# Altium project PCB_Project1.PrjPCB
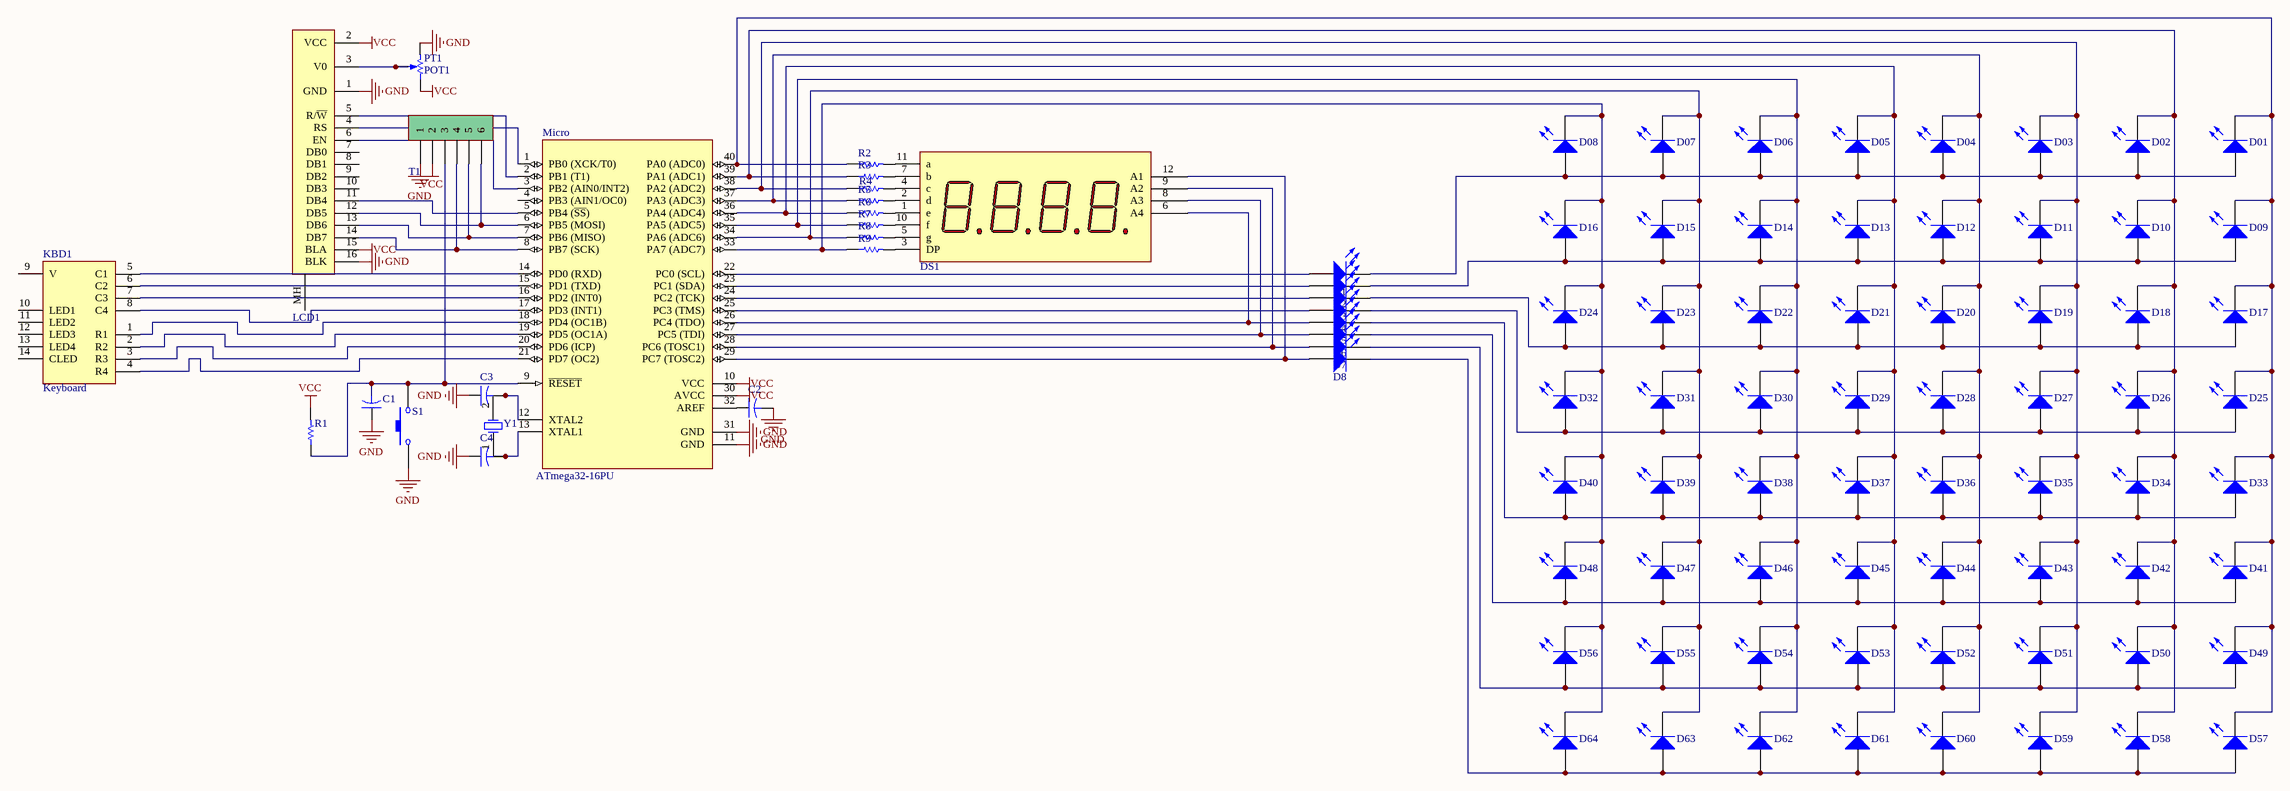
[diagram p0: Sheet1.SchDoc]
3 sheets, 96 parts. Net scope: global (net labels, ports and power ports of the same name join across sheets).
Board file: PCB1.PcbDoc
Sheets:
  Sheet1.SchDoc
  Sheet2.SchDoc
  Sheet4.SchDoc

## Sheet Sheet1.SchDoc
size E

### Parts
C1  (no value)  [CAPR5-4X5]
C2  (no value)  [CAPR5-4X5]
C3  (no value)  [CAPR5-4X5]
C4  (no value)  [CAPR5-4X5]
D01  LED 3mm  [LED-3mm]  (value not drawn)
D1  LED 3mm  [LED-3mm]  (value not drawn)
D02  LED 3mm  [LED-3mm]  (value not drawn)
D2  LED 3mm  [LED-3mm]  (value not drawn)
D03  LED 3mm  [LED-3mm]  (value not drawn)
D3  LED 3mm  [LED-3mm]  (value not drawn)
D04  LED 3mm  [LED-3mm]  (value not drawn)
D4  LED 3mm  [LED-3mm]  (value not drawn)
D05  LED 3mm  [LED-3mm]  (value not drawn)
D5  LED 3mm  [LED-3mm]  (value not drawn)
D06  LED 3mm  [LED-3mm]  (value not drawn)
D6  LED 3mm  [LED-3mm]  (value not drawn)
D07  LED 3mm  [LED-3mm]  (value not drawn)
D7  LED 3mm  [LED-3mm]  (value not drawn)
D08  LED 3mm  [LED-3mm]  (value not drawn)
D8  LED 3mm  [LED-3mm]  (value not drawn)
D09  LED 3mm  [LED-3mm]  (value not drawn)
D10  LED 3mm  [LED-3mm]  (value not drawn)
D11  LED 3mm  [LED-3mm]  (value not drawn)
D12  LED 3mm  [LED-3mm]  (value not drawn)
D13  LED 3mm  [LED-3mm]  (value not drawn)
D14  LED 3mm  [LED-3mm]  (value not drawn)
D15  LED 3mm  [LED-3mm]  (value not drawn)
D16  LED 3mm  [LED-3mm]  (value not drawn)
D17  LED 3mm  [LED-3mm]  (value not drawn)
D18  LED 3mm  [LED-3mm]  (value not drawn)
D19  LED 3mm  [LED-3mm]  (value not drawn)
D20  LED 3mm  [LED-3mm]  (value not drawn)
D21  LED 3mm  [LED-3mm]  (value not drawn)
D22  LED 3mm  [LED-3mm]  (value not drawn)
D23  LED 3mm  [LED-3mm]  (value not drawn)
D24  LED 3mm  [LED-3mm]  (value not drawn)
D25  LED 3mm  [LED-3mm]  (value not drawn)
D26  LED 3mm  [LED-3mm]  (value not drawn)
D27  LED 3mm  [LED-3mm]  (value not drawn)
D28  LED 3mm  [LED-3mm]  (value not drawn)
D29  LED 3mm  [LED-3mm]  (value not drawn)
D30  LED 3mm  [LED-3mm]  (value not drawn)
D31  LED 3mm  [LED-3mm]  (value not drawn)
D32  LED 3mm  [LED-3mm]  (value not drawn)
D33  LED 3mm  [LED-3mm]  (value not drawn)
D34  LED 3mm  [LED-3mm]  (value not drawn)
D35  LED 3mm  [LED-3mm]  (value not drawn)
D36  LED 3mm  [LED-3mm]  (value not drawn)
D37  LED 3mm  [LED-3mm]  (value not drawn)
D38  LED 3mm  [LED-3mm]  (value not drawn)
D39  LED 3mm  [LED-3mm]  (value not drawn)
D40  LED 3mm  [LED-3mm]  (value not drawn)
D41  LED 3mm  [LED-3mm]  (value not drawn)
D42  LED 3mm  [LED-3mm]  (value not drawn)
D43  LED 3mm  [LED-3mm]  (value not drawn)
D44  LED 3mm  [LED-3mm]  (value not drawn)
D45  LED 3mm  [LED-3mm]  (value not drawn)
D46  LED 3mm  [LED-3mm]  (value not drawn)
D47  LED 3mm  [LED-3mm]  (value not drawn)
D48  LED 3mm  [LED-3mm]  (value not drawn)
D49  LED 3mm  [LED-3mm]  (value not drawn)
D50  LED 3mm  [LED-3mm]  (value not drawn)
D51  LED 3mm  [LED-3mm]  (value not drawn)
D52  LED 3mm  [LED-3mm]  (value not drawn)
D53  LED 3mm  [LED-3mm]  (value not drawn)
D54  LED 3mm  [LED-3mm]  (value not drawn)
D55  LED 3mm  [LED-3mm]  (value not drawn)
D56  LED 3mm  [LED-3mm]  (value not drawn)
D57  LED 3mm  [LED-3mm]  (value not drawn)
D58  LED 3mm  [LED-3mm]  (value not drawn)
D59  LED 3mm  [LED-3mm]  (value not drawn)
D60  LED 3mm  [LED-3mm]  (value not drawn)
D61  LED 3mm  [LED-3mm]  (value not drawn)
D62  LED 3mm  [LED-3mm]  (value not drawn)
D63  LED 3mm  [LED-3mm]  (value not drawn)
D64  LED 3mm  [LED-3mm]  (value not drawn)
DS1  7Segment-4Digit-CA  [7segCA]  (value not drawn)
KBD1  Keyboard  [Keyboard]
LCD1  20x4  [LCD 16x2]  (value not drawn)
Micro  ATmega32-16PU  [40P6]
PT1  POT1  [POT1]
R1  Resistor vertical  [Res50]  (value not drawn)
R2  Resistor vertical  [Res50]  (value not drawn)
R3  Resistor vertical  [Res50]  (value not drawn)
R4  Resistor vertical  [Res50]  (value not drawn)
R5  Resistor vertical  [Res50]  (value not drawn)
R6  Resistor vertical  [Res50]  (value not drawn)
R7  Resistor vertical  [Res50]  (value not drawn)
R8  Resistor vertical  [Res50]  (value not drawn)
R9  Resistor vertical  [Res50]  (value not drawn)
S1  (no value)  [SPST-2]
T1  Phoenix terminal  [phoenix terminal 6]  (value not drawn)
Y1  (no value)  [R38]

### Nets
GND: C1.1 C2.2 C3.1 C4.1 LCD1.1(GND) LCD1.16(BLK) Micro.11(GND) Micro.31(GND) PT1.2(BOT) S1.1 T1.1
VCC: LCD1.2(VCC) LCD1.15(BLA) Micro.10(VCC) Micro.30(AVCC) PT1.1(TOP) R1.2 T1.2
NetC1_2: C1.2 Micro.9(~{RESET}) R1.1 S1.2 T1.3
NetC2_1: C2.1 Micro.32(AREF)
NetC3_2: C3.2 Micro.12(XTAL2) Y1.2(OSC2)
NetC4_2: C4.2 Micro.13(XTAL1) Y1.1(OSC1)
NetD1_1: D1.1(A) Micro.22(PC0_(SCL))
NetD01_1: D01.1(A) D1.2(K) D02.1(A) D03.1(A) D04.1(A) D05.1(A) D06.1(A) D07.1(A) D08.1(A)
NetD01_2: D01.2(K) D09.2(K) D17.2(K) D25.2(K) D33.2(K) D41.2(K) D49.2(K) D57.2(K) Micro.40(PA0_(ADC0)) R2.1
NetD2_1: D2.1(A) Micro.23(PC1_(SDA))
NetD02_2: D02.2(K) D10.2(K) D18.2(K) D26.2(K) D34.2(K) D42.2(K) D50.2(K) D58.2(K) Micro.39(PA1_(ADC1)) R3.1
NetD2_2: D2.2(K) D09.1(A) D10.1(A) D11.1(A) D12.1(A) D13.1(A) D14.1(A) D15.1(A) D16.1(A)
NetD3_1: D3.1(A) Micro.24(PC2_(TCK))
NetD03_2: D03.2(K) D11.2(K) D19.2(K) D27.2(K) D35.2(K) D43.2(K) D51.2(K) D59.2(K) Micro.38(PA2_(ADC2)) R4.1
NetD3_2: D3.2(K) D17.1(A) D18.1(A) D19.1(A) D20.1(A) D21.1(A) D22.1(A) D23.1(A) D24.1(A)
NetD4_1: D4.1(A) Micro.25(PC3_(TMS))
NetD04_2: D04.2(K) D12.2(K) D20.2(K) D28.2(K) D36.2(K) D44.2(K) D52.2(K) D60.2(K) Micro.37(PA3_(ADC3)) R5.1
NetD4_2: D4.2(K) D25.1(A) D26.1(A) D27.1(A) D28.1(A) D29.1(A) D30.1(A) D31.1(A) D32.1(A)
NetD5_1: D5.1(A) DS1.6(A4) Micro.26(PC4_(TDO))
NetD05_2: D05.2(K) D13.2(K) D21.2(K) D29.2(K) D37.2(K) D45.2(K) D53.2(K) D61.2(K) Micro.36(PA4_(ADC4)) R6.1
NetD5_2: D5.2(K) D33.1(A) D34.1(A) D35.1(A) D36.1(A) D37.1(A) D38.1(A) D39.1(A) D40.1(A)
NetD6_1: D6.1(A) DS1.8(A3) Micro.27(PC5_(TDI))
NetD06_2: D06.2(K) D14.2(K) D22.2(K) D30.2(K) D38.2(K) D46.2(K) D54.2(K) D62.2(K) Micro.35(PA5_(ADC5)) R7.1
NetD6_2: D6.2(K) D41.1(A) D42.1(A) D43.1(A) D44.1(A) D45.1(A) D46.1(A) D47.1(A) D48.1(A)
NetD7_1: D7.1(A) DS1.9(A2) Micro.28(PC6_(TOSC1))
NetD07_2: D07.2(K) D15.2(K) D23.2(K) D31.2(K) D39.2(K) D47.2(K) D55.2(K) D63.2(K) Micro.34(PA6_(ADC6)) R8.1
NetD7_2: D7.2(K) D49.1(A) D50.1(A) D51.1(A) D52.1(A) D53.1(A) D54.1(A) D55.1(A) D56.1(A)
NetD8_1: D8.1(A) DS1.12(A1) Micro.29(PC7_(TOSC2))
NetD08_2: D08.2(K) D16.2(K) D24.2(K) D32.2(K) D40.2(K) D48.2(K) D56.2(K) D64.2(K) Micro.33(PA7_(ADC7)) R9.1
NetD8_2: D8.2(K) D57.1(A) D58.1(A) D59.1(A) D60.1(A) D61.1(A) D62.1(A) D63.1(A) D64.1(A)
NetDS1_1: DS1.1(e) R6.2
NetDS1_2: DS1.2(d) R5.2
NetDS1_3: DS1.3(DP) R9.2
NetDS1_4: DS1.4(c) R4.2
NetDS1_5: DS1.5(g) R8.2
NetDS1_7: DS1.7(b) R3.2
NetDS1_10: DS1.10(f) R7.2
NetDS1_11: DS1.11(a) R2.2
NetKBD1_1: KBD1.1(R1) Micro.18(PD4_(OC1B))
NetKBD1_2: KBD1.2(R2) Micro.19(PD5_(OC1A))
NetKBD1_3: KBD1.3(R3) Micro.20(PD6_(ICP))
NetKBD1_4: KBD1.4(R4) Micro.21(PD7_(OC2))
NetKBD1_5: KBD1.5(C1) Micro.14(PD0_(RXD))
NetKBD1_6: KBD1.6(C2) Micro.15(PD1_(TXD))
NetKBD1_7: KBD1.7(C3) Micro.16(PD2_(INT0))
NetKBD1_8: KBD1.8(C4) Micro.17(PD3_(INT1))
NetLCD1_3: LCD1.3(V0) PT1.3(TAP)
NetLCD1_4: LCD1.4(RS) Micro.1(PB0_(XCK/T0))
NetLCD1_5: LCD1.5(R/~{W}) Micro.2(PB1_(T1))
NetLCD1_6: LCD1.6(EN) Micro.3(PB2_(AIN0/INT2))
NetLCD1_11: LCD1.11(DB4) Micro.5(PB4_(~{SS}))
NetLCD1_12: LCD1.12(DB5) Micro.6(PB5_(MOSI)) T1.6
NetLCD1_13: LCD1.13(DB6) Micro.7(PB6_(MISO)) T1.5
NetLCD1_14: LCD1.14(DB7) Micro.8(PB7_(SCK)) T1.4

Not connected (* = marked no-connect by the designer): KBD1 9(V) 10(LED1) 11(LED2) 12(LED3) 13(LED4) 14(CLED); LCD1 7(DB0) 8(DB1) 9(DB2) 10(DB3) MH; Micro 4(PB3_(AIN1/OC0))

### Library data of the parts
C1-C4 = Cap2: Capacitor; Published: 23-Sep-2002; PackageReference: CAPR5-4X5; Publisher: Altium Limited
D01 D1 D02 D2 D03 D3 D04 D4 D05 D5 D06 D6 D07 D7 D08 D8 D09-D64 = LED 3mm: Typical LED; Designer: Seyed Mohsen Ghasemian; Published: 02/04/2012; PackageReference: LED; Publisher: www.picpars.com; PackageDescription: LED; 2 Leads
DS1 = 7Seg-4Digit-CA: 7-Segment Display: CA; Colour: Read; Designer: Seyed Mohsen Ghasemain; Published: 07/31/2012; Publisher: www.picpars.com; ComponentLink1URL: http://www.picpars.com/
KBD1 = Keyboard Matrix 4x4: Designer: Saeid Jorablo; Company: Personal; Project Name: Abtahi; Adding Date: 10/21/2009
LCD1 = LCD: Designer: Saeid Jorablo; Company: My self; Adding Date: 10/21/2009; LCDType: 20x4
Micro = ATmega32-16PU: 8-bit AVR Microcontroller, 4.5-5.5V, 16MHz, 32KB Flash, 1024 Bytes EEPROM, 2KB SRAM, 40-pin PDIP, Industrial Grade (-40°C to 85°C); DatasheetVersion: revQ, Feb-2011; PackageVersion: revB, Sep-2001; PackageReference: 40P6; PackageDescription: 40-lead (0.600"/15.24mm Wide) Plastic Dual Inline Package (PDIP); Code_JEDEC: MS-011-AC; ComponentLink1Description: Manufacturer URL; ComponentLink1URL: http://www.atmel.com/; ComponentLink2Description: ATmega32(L) Datasheet; ComponentLink2URL: http://atmel.com/dyn/resources/prod_documents/doc2503.pdf; ComponentLink3Description: ATmega32(L) Summary; ComponentLink3URL: http://atmel.com/dyn/resources/prod_documents/2503S.pdf
PT1 = POT1: Variable Potentiometer standing; Designer: Seyed Mohsen Ghasemian; WEB: www.picpars.com
R1-R9 = Resistor vertical: Resistor 0.5; Publisher: Seyed mohsen ghasemian; WEB: www.picpars.com
S1 = SW-PB: Switch; Published: 24-Mar-1999; LatestRevisionDate: 17-Jul-2002; LatestRevisionNote: Re-released for DXP Platform.; PackageReference: SPST-2; Publisher: Altium Limited
T1 = Phoenix terminal 6: Terminal 6 Pin; Designer: Seyed Mohsen Ghasemain; E-mail: picpars@gmail.com; ComponentLinkURL: www.picpars.com
Y1 = XTAL: Crystal Oscillator; Published: 8-Jun-2000; LatestRevisionDate: 17-Jul-2002; LatestRevisionNote: Re-released for DXP Platform.; PackageReference: R38; Publisher: Altium Limited

## Sheet Sheet2.SchDoc
size A
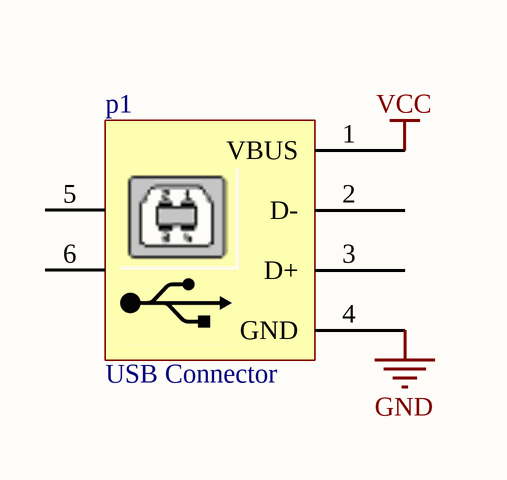
[diagram p1: Sheet2.SchDoc]

### Parts
p1  USB Connector  [USB2.5-2H4E]

### Nets
GND: p1.4(GND)
VCC: p1.1(VBUS)

Not connected (* = marked no-connect by the designer): p1 2(D-) 3(D+) 5 6

### Library data of the parts
p1 = USB: USB Connector-B Type; Designer: Eng. Saeid Jorablo; Company: DASE Co; Adding Date: 10/26/2010

## Sheet Sheet4.SchDoc
size A
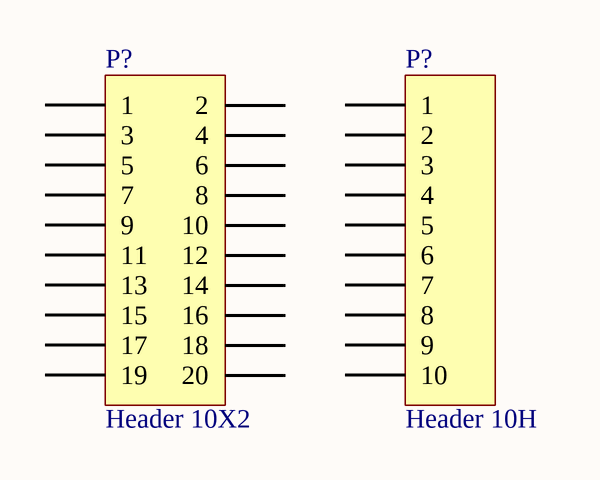
[diagram p2: Sheet4.SchDoc]

### Parts
(Parts that share a designator on the sheet are numbered #1, #2 ... from top to bottom, then left to right.)
P?#1  Header 10X2  [HDR2X10]
P?#2  Header 10H  [HDR1X10H]

### Nets

Not connected (* = marked no-connect by the designer): P?#1 1 2 3 4 5 6 7 8 9 10 11 12 13 14 15 16 17 18 19 20; P?#2 1 2 3 4 5 6 7 8 9 10

### Library data of the parts
P?#1 = Header 10X2: Header, 10-Pin, Dual row; LatestRevisionDate: 17-Jul-2002; LatestRevisionNote: Re-released for DXP Platform.; Publisher: Altium Limited
P?#2 = Header 10H: Header, 10-Pin, Right Angle; LatestRevisionDate: 17-Jul-2002; LatestRevisionNote: Re-released for DXP Platform.; Publisher: Altium Limited

## Nets that join several sheets
GND: Sheet1 (11 pins), Sheet2 (p1.4)
VCC: Sheet1 (7 pins), Sheet2 (p1.1)